# Altium schematic sheet Main.SchDoc
size A2; SheetNumber: 1; SheetTotal: 5
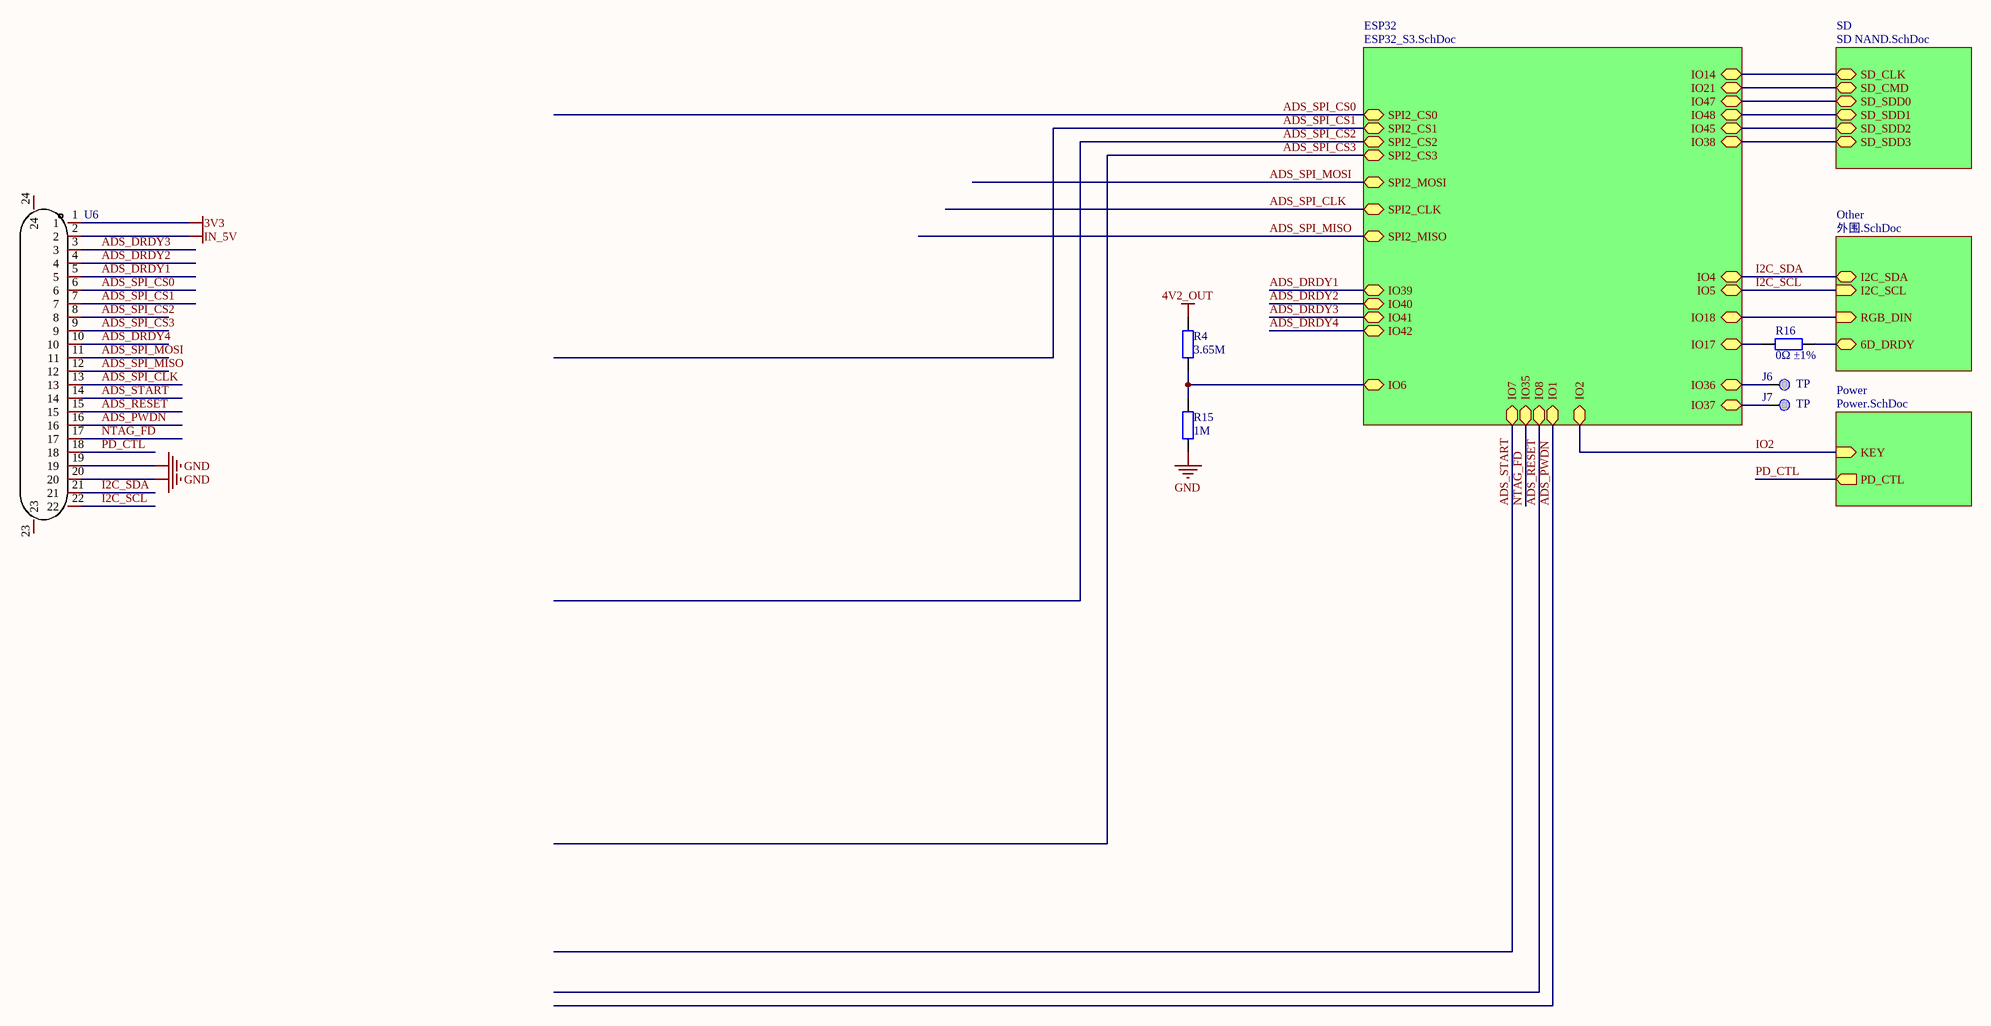
[diagram p0: Main.SchDoc]

## Parts
J6  TP  [TEST_Point]
J7  TP  [TEST_Point]
R4  3.65M  [0603_R]
R15  1M  [0603_R]
R16  0Ω ±1%  [0402_R]
U6  KH-FPC0.5-H1.0SMT-22P-QCHF  [FPC-SMD_22P-P0.50_XKB_X05A10L22G]  (value not drawn)

## Sub-sheets
ESP32 = ESP32_S3.SchDoc: SPI2_CLK (bidir), SPI2_MISO (bidir), SPI2_MOSI (bidir), SPI2_CS0 (bidir), SPI2_CS1 (bidir), SPI2_CS2 (bidir), SPI2_CS3 (bidir), IO4 (bidir), IO5 (bidir), IO6 (bidir), IO7 (bidir), IO17 (bidir), IO8 (bidir), IO1 (bidir), IO2 (bidir), IO14 (bidir), IO21 (bidir), IO47 (bidir), IO48 (bidir), IO45 (bidir), IO38 (bidir), IO39 (bidir), IO40 (bidir), IO41 (bidir), IO42 (bidir), IO18 (bidir), IO35 (bidir), IO36 (bidir), IO37 (bidir)
Other = 外围.SchDoc: I2C_SCL (in), I2C_SDA (bidir), RGB_DIN (in), 6D_DRDY (bidir)
Power = Power.SchDoc: KEY (in), PD_CTL (out)
SD = SD NAND.SchDoc: SD_CLK (bidir), SD_CMD (bidir), SD_SDD0 (bidir), SD_SDD1 (bidir), SD_SDD2 (bidir), SD_SDD3 (bidir)

## Nets
3V3: U6.1
4V2_OUT: R4.1
GND: R15.2 U6.19 U6.20
IN_5V: U6.2
ADS_DRDY1: U6.5 ; sheet ESP32/IO39
ADS_DRDY2: U6.4 ; sheet ESP32/IO40
ADS_DRDY3: U6.3 ; sheet ESP32/IO41
ADS_DRDY4: U6.10 ; sheet ESP32/IO42
ADS_PWDN: U6.16 ; sheet ESP32/IO1
ADS_RESET: U6.15 ; sheet ESP32/IO8
ADS_SPI_CLK: U6.13 ; sheet ESP32/SPI2_CLK
ADS_SPI_CS0: U6.6 ; sheet ESP32/SPI2_CS0
ADS_SPI_CS1: U6.7 ; sheet ESP32/SPI2_CS1
ADS_SPI_CS2: U6.8 ; sheet ESP32/SPI2_CS2
ADS_SPI_CS3: U6.9 ; sheet ESP32/SPI2_CS3
ADS_SPI_MISO: U6.12 ; sheet ESP32/SPI2_MISO
ADS_SPI_MOSI: U6.11 ; sheet ESP32/SPI2_MOSI
ADS_START: U6.14 ; sheet ESP32/IO7
I2C_SCL: U6.22 ; sheet ESP32/IO5, sheet Other/I2C_SCL
I2C_SDA: U6.21 ; sheet ESP32/IO4, sheet Other/I2C_SDA
IO2: sheet ESP32/IO2, sheet Power/KEY
NTAG_FD: U6.17 ; sheet ESP32/IO35
PD_CTL: U6.18 ; sheet Power/PD_CTL
NetJ6_1: J6.1 ; sheet ESP32/IO36
NetJ7_1: J7.1 ; sheet ESP32/IO37
NetR4_2: R4.2 R15.1 ; sheet ESP32/IO6
NetR16_1: R16.1 ; sheet ESP32/IO17
NetR16_2: R16.2 ; sheet Other/6D_DRDY
(unnamed): sheet ESP32/IO14, sheet SD/SD_CLK
(unnamed): sheet ESP32/IO21, sheet SD/SD_CMD
(unnamed): sheet ESP32/IO47, sheet SD/SD_SDD0
(unnamed): sheet ESP32/IO48, sheet SD/SD_SDD1
(unnamed): sheet ESP32/IO45, sheet SD/SD_SDD2
(unnamed): sheet ESP32/IO38, sheet SD/SD_SDD3
(unnamed): sheet ESP32/IO18, sheet Other/RGB_DIN

Not connected (* = marked no-connect by the designer): U6 23 24

## Library data of the parts
J6 J7 = TestPad: Add into BOM: yes
R4 R15 R16 = Res2: Resistor; Add into BOM: yes; PackageReference: AXIAL-0.4; PackageDescription: Axial Device, Thru-Hole; 2 Leads; 0.4 in Pin Spacing
  R4: Value: 3.65M
  R15: Value: 1M
  R16: Value: 0Ω ±1%
U6 = KH-FPC0.5-H1.0SMT-22P-QCHF: 锁定特性:翻盖式;触点数量:22P;间距:0.5mm;; Manufacturer: kinghelm(金航标); Add into BOM: yes; Locking Feature: 翻盖式; Number of Contacts: 22P; Pitch: 0.5mm; Name: KH-FPC0.5-H1.0SMT-22P-QCHF; Symbol: KH-FPC0.5-H1.0SMT-22P-QCHF; Device: KH-FPC0.5-H1.0SMT-22P-QCHF; LCSC Part Name: KH-FPC0.5-H1.0SMT-22P-QCHF; Supplier Part: C3250120; Manufacturer Part: KH-FPC0.5-H1.0SMT-22P-QCHF; Supplier Footprint: SMD,P=0.5mm; JLCPCB Part Class: 扩展库; Datasheet: https://atta.szlcsc.com/upload/public/pdf/source/20220629/AF128159C3D91429B5983CCCE2A07C6D.pdf; Supplier: LCSC; Convert to PCB: yes; Height Above Board: 1mm